# Altium project lan9254.PrjPcb (part 3 of 5)

## Sheet Page 05-LAN9254-Part2.SchDoc
size 416 x 264 mm; DrawnBy: Xuelu Li; Engineer: Parthiv/Xuelu; DocumentNumber: 5; Revision: A0; SheetNumber: 5; SheetTotal: 8; PageSetup: Record=PageOptions|CenterHorizontal=True|CenterVertical=True|PrintScale=1.02|XCorrection=1.00|YCorrection=1.00|PrintKind=0|BorderSize=5000000|LeftOffset=0|BottomOffset=0|Orientation=2|PaperLength=1000|PaperWidth=1000|Scale=100|PaperSource=15|PrintQuality=600|MediaType=1|DitherType=10|PrintScaleMode=1|PaperKind=11x17|PaperIndex=17; PageTitle: LAN9254-Page2; ProjName: EVB-LAN9254-DIGIO; DesignDescription: LAN9254 Evaluation Board; Designer: Xuelu Li; PartNumber: EVB-LAN9254-DIGIO; Sheet1Title: LAN9254-Page2; DocumentFullPathAndName: //depot_np_hweng_boards/ung_hweng/UNG_8017_EVB-USB5926/; ProjectName: lan9254.PrjPcb
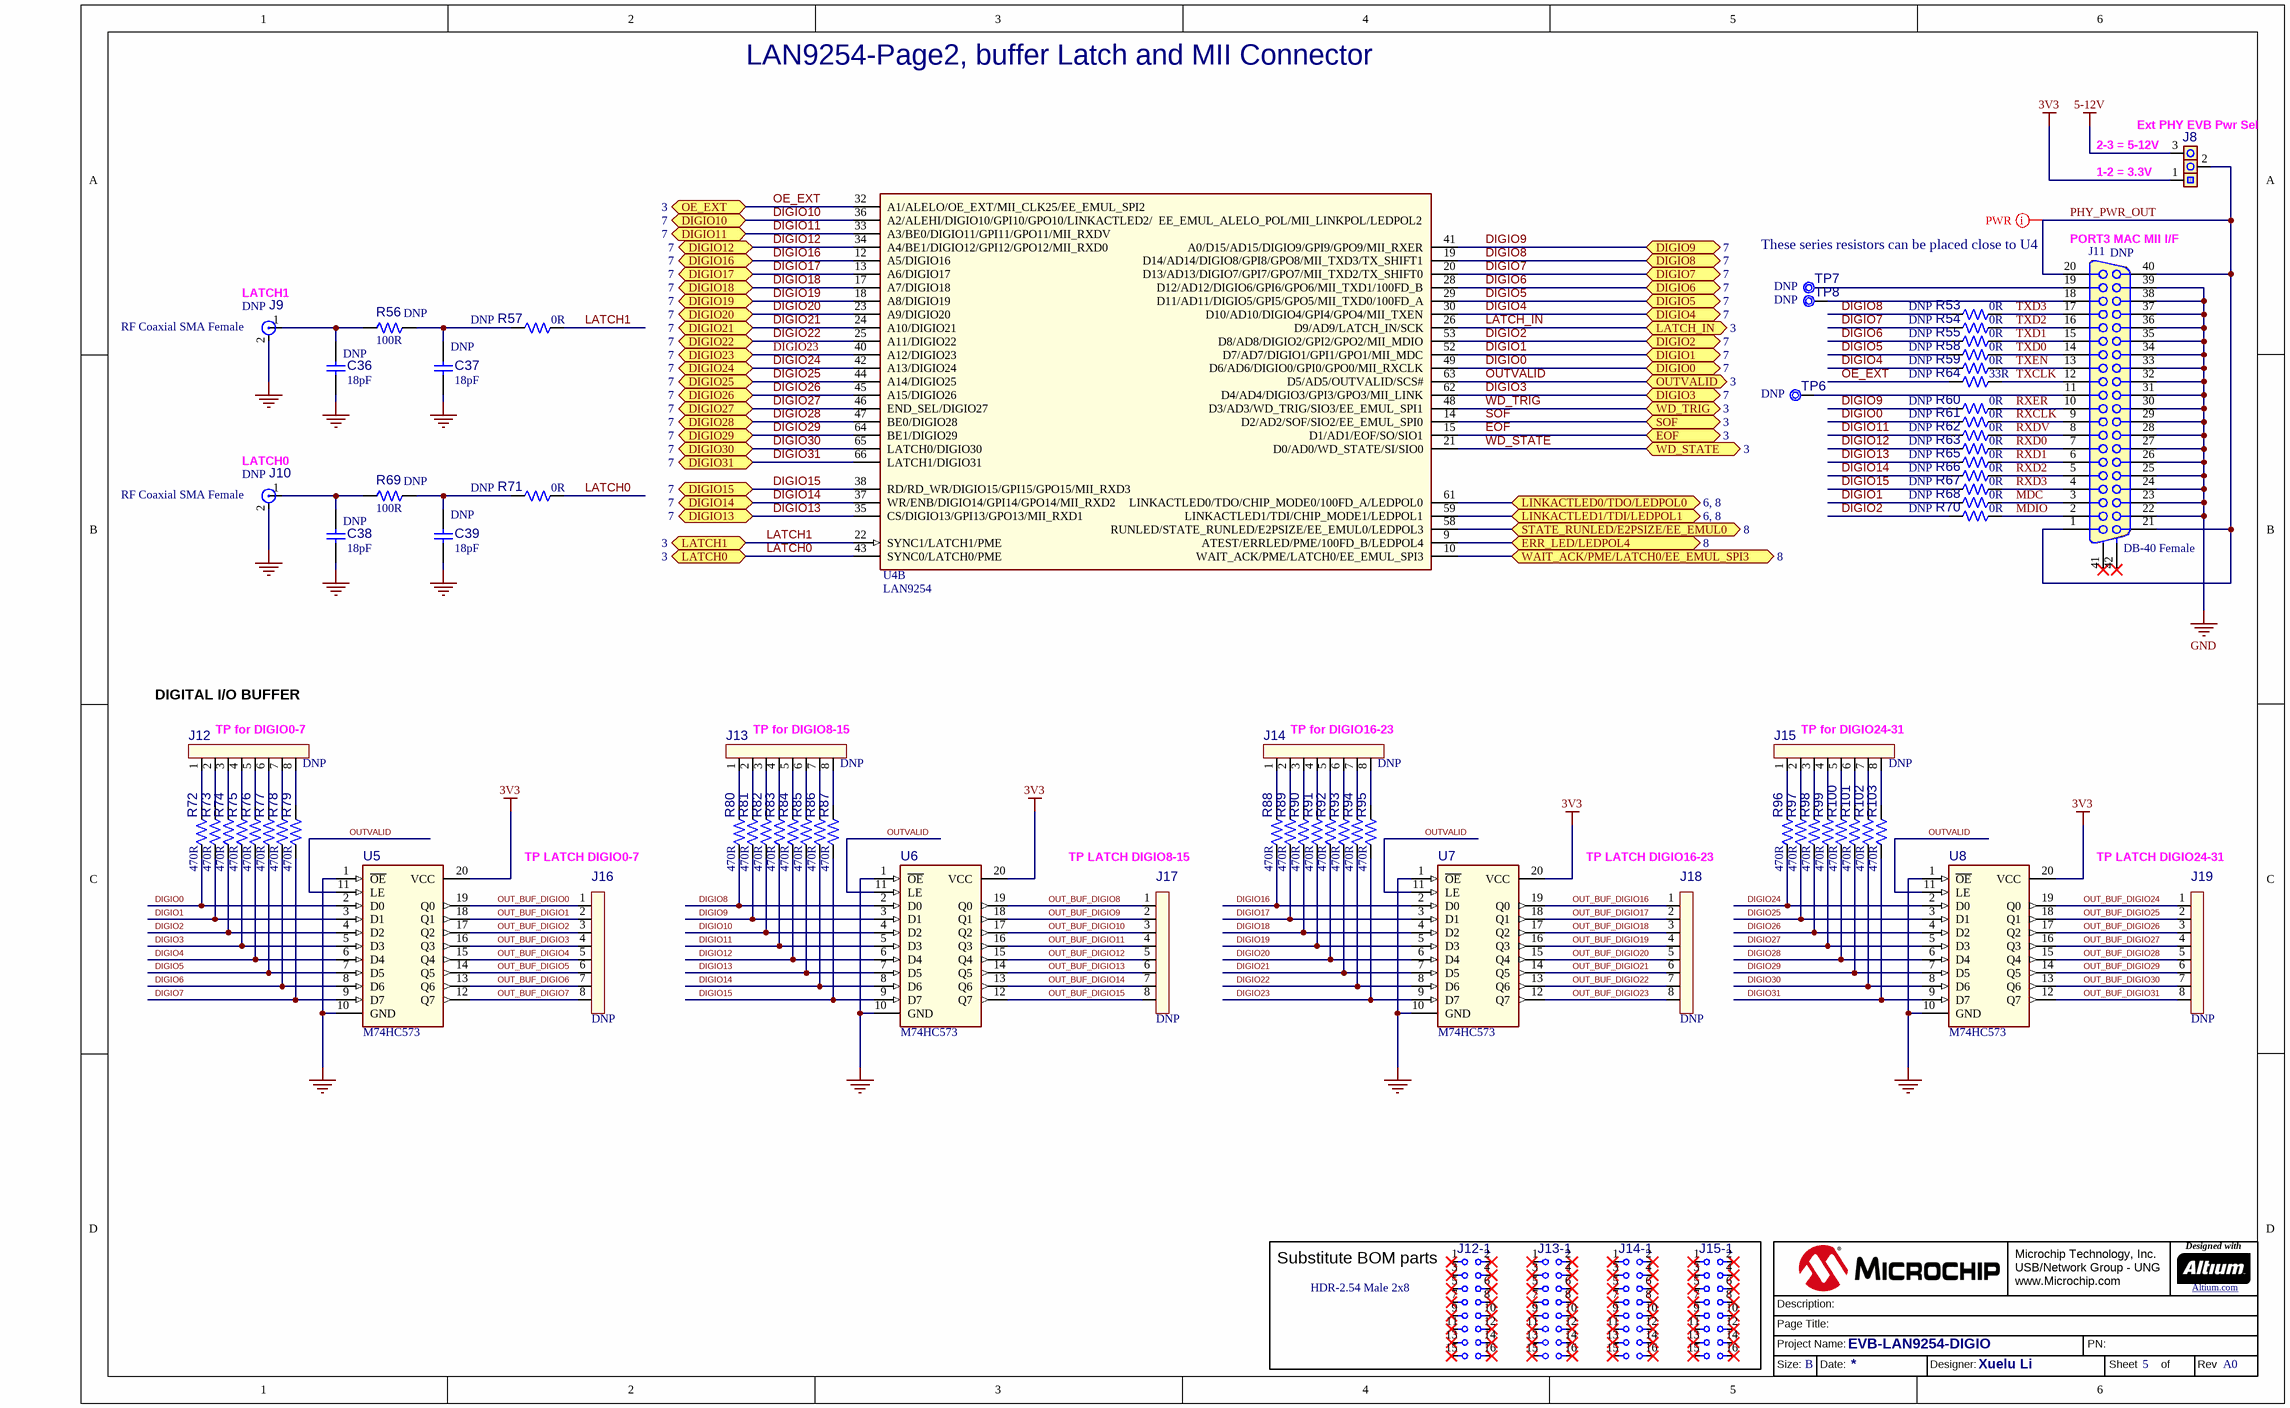
[diagram p4: Page 05-LAN9254-Part2.SchDoc]

### Parts
(Parts that share a designator on the sheet are numbered #1, #2 ... from top to bottom, then left to right.)
?#5  (no value)  (graphical)
C36  value 18pF  Populated: DNP  [CAP_C_0805]  (hidden comment: Capacitor NP)
C37  value 18pF  Populated: DNP  [CAP_C_0805]  (hidden comment: Capacitor NP)
C38  value 18pF  Populated: DNP  [CAP_C_0805]  (hidden comment: Capacitor NP)
C39  value 18pF  Populated: DNP  [CAP_C_0805]  (hidden comment: Capacitor NP)
J8  Header 1x3  [HDR_M_2.54_1x3]  (value not drawn)
J9  value RF Coaxial SMA Female  Populated: DNP  [CON_JACK_F_TH_V_ACP_901-144-8RFX]  (hidden comment: CON Jack 2 Pins)
J10  value RF Coaxial SMA Female  Populated: DNP  [CON_JACK_F_TH_V_ACP_901-144-8RFX]  (hidden comment: CON Jack 2 Pins)
J11  value DB-40 Female  Populated: DNP  [CON_DSUB40_TH_RA_F]  (hidden comment: CON DB-40)
J12  Populated: DNP  [HDR_M_2.54_1x8-doubled]  (hidden comment: HDR_M_2.54_1x8-doubled)  (no BOM)
J12-1  value HDR-2.54 Male 2x8  [HDR_M_2.54_2x8]  (hidden comment: Header 2x8)  (mechanical)
J13  Populated: DNP  [HDR_M_2.54_1x8-doubled]  (hidden comment: HDR_M_2.54_1x8-doubled)  (no BOM)
J13-1  Header 2x8  [HDR_M_2.54_2x8]  (value not drawn)  (mechanical)
J14  Populated: DNP  [HDR_M_2.54_1x8-doubled]  (hidden comment: HDR_M_2.54_1x8-doubled)  (no BOM)
J14-1  Header 2x8  [HDR_M_2.54_2x8]  (value not drawn)  (mechanical)
J15  Populated: DNP  [HDR_M_2.54_1x8-doubled]  (hidden comment: HDR_M_2.54_1x8-doubled)  (no BOM)
J15-1  Header 2x8  [HDR_M_2.54_2x8]  (value not drawn)  (mechanical)
J16  Populated: DNP  [HDR_M_2.54_1x8-stripped]  (hidden comment: HDR_M_2.54_1x8-stripped)  (no BOM)
J17  Populated: DNP  [HDR_M_2.54_1x8-stripped]  (hidden comment: HDR_M_2.54_1x8-stripped)  (no BOM)
J18  Populated: DNP  [HDR_M_2.54_1x8-stripped]  (hidden comment: HDR_M_2.54_1x8-stripped)  (no BOM)
J19  Populated: DNP  [HDR_M_2.54_1x8-stripped]  (hidden comment: HDR_M_2.54_1x8-stripped)  (no BOM)
R53  value 0R  Populated: DNP  [RES_C_0402]  (hidden comment: Resistor)
R54  value 0R  Populated: DNP  [RES_C_0402]  (hidden comment: Resistor)
R55  value 0R  Populated: DNP  [RES_C_0402]  (hidden comment: Resistor)
R56  value 100R  Populated: DNP  [RES_C_0805]  (hidden comment: Resistor)
R57  value 0R  Populated: DNP  [RES_C_0402]  (hidden comment: Resistor)
R58  value 0R  Populated: DNP  [RES_C_0402]  (hidden comment: Resistor)
R59  value 0R  Populated: DNP  [RES_C_0402]  (hidden comment: Resistor)
R60  value 0R  Populated: DNP  [RES_C_0402]  (hidden comment: Resistor)
R61  value 0R  Populated: DNP  [RES_C_0402]  (hidden comment: Resistor)
R62  value 0R  Populated: DNP  [RES_C_0402]  (hidden comment: Resistor)
R63  value 0R  Populated: DNP  [RES_C_0402]  (hidden comment: Resistor)
R64  value 33R  Populated: DNP  [RES_C_0402]  (hidden comment: Resistor)
R65  value 0R  Populated: DNP  [RES_C_0402]  (hidden comment: Resistor)
R66  value 0R  Populated: DNP  [RES_C_0402]  (hidden comment: Resistor)
R67  value 0R  Populated: DNP  [RES_C_0402]  (hidden comment: Resistor)
R68  value 0R  Populated: DNP  [RES_C_0402]  (hidden comment: Resistor)
R69  value 100R  Populated: DNP  [RES_C_0805]  (hidden comment: Resistor)
R70  value 0R  Populated: DNP  [RES_C_0402]  (hidden comment: Resistor)
R71  value 0R  Populated: DNP  [RES_C_0402]  (hidden comment: Resistor)
R72  value 470R  [RES_C_0402]  (hidden comment: Resistor)
R73  value 470R  [RES_C_0402]  (hidden comment: Resistor)
R74  value 470R  [RES_C_0402]  (hidden comment: Resistor)
R75  value 470R  [RES_C_0402]  (hidden comment: Resistor)
R76  value 470R  [RES_C_0402]  (hidden comment: Resistor)
R77  value 470R  [RES_C_0402]  (hidden comment: Resistor)
R78  value 470R  [RES_C_0402]  (hidden comment: Resistor)
R79  value 470R  [RES_C_0402]  (hidden comment: Resistor)
R80  value 470R  [RES_C_0402]  (hidden comment: Resistor)
R81  value 470R  [RES_C_0402]  (hidden comment: Resistor)
R82  value 470R  [RES_C_0402]  (hidden comment: Resistor)
R83  value 470R  [RES_C_0402]  (hidden comment: Resistor)
R84  value 470R  [RES_C_0402]  (hidden comment: Resistor)
R85  value 470R  [RES_C_0402]  (hidden comment: Resistor)
R86  value 470R  [RES_C_0402]  (hidden comment: Resistor)
R87  value 470R  [RES_C_0402]  (hidden comment: Resistor)
R88  value 470R  [RES_C_0402]  (hidden comment: Resistor)
R89  value 470R  [RES_C_0402]  (hidden comment: Resistor)
R90  value 470R  [RES_C_0402]  (hidden comment: Resistor)
R91  value 470R  [RES_C_0402]  (hidden comment: Resistor)
R92  value 470R  [RES_C_0402]  (hidden comment: Resistor)
R93  value 470R  [RES_C_0402]  (hidden comment: Resistor)
R94  value 470R  [RES_C_0402]  (hidden comment: Resistor)
R95  value 470R  [RES_C_0402]  (hidden comment: Resistor)
R96  value 470R  [RES_C_0402]  (hidden comment: Resistor)
R97  value 470R  [RES_C_0402]  (hidden comment: Resistor)
R98  value 470R  [RES_C_0402]  (hidden comment: Resistor)
R99  value 470R  [RES_C_0402]  (hidden comment: Resistor)
R100  value 470R  [RES_C_0402]  (hidden comment: Resistor)
R101  value 470R  [RES_C_0402]  (hidden comment: Resistor)
R102  value 470R  [RES_C_0402]  (hidden comment: Resistor)
R103  value 470R  [RES_C_0402]  (hidden comment: Resistor)
TP6  Populated: DNP  [TP_1.2x0.7]  (hidden comment: Test Point No BOM)  (no BOM)
TP7  Populated: DNP  [TP_1.2x0.7]  (hidden comment: Test Point No BOM)  (no BOM)
TP8  Populated: DNP  [TP_1.2x0.7]  (hidden comment: Test Point No BOM)  (no BOM)
U4  value LAN9254  [TQFP-80_12x12_EP6x6]  (hidden comment: LAN9254-SVB TQFP80)  (part B of 2)
U5  value M74HC573  [TSSOP-20]  (hidden comment: 74HC573 TSSOP-20)
U6  value M74HC573  [TSSOP-20]  (hidden comment: 74HC573 TSSOP-20)
U7  value M74HC573  [TSSOP-20]  (hidden comment: 74HC573 TSSOP-20)
U8  value M74HC573  [TSSOP-20]  (hidden comment: 74HC573 TSSOP-20)

### Blocks framed on the sheet
Substitute BOM parts: J12-1 J13-1 J14-1 J15-1

### Ports
DIGIO0 (bidir, see 7), DIGIO1 (bidir, see 7), DIGIO2 (bidir, see 7), DIGIO3 (bidir, see 7), DIGIO4 (bidir, see 7), DIGIO5 (bidir, see 7), DIGIO6 (bidir, see 7), DIGIO7 (bidir, see 7), DIGIO8 (bidir, see 7), DIGIO9 (bidir, see 7), DIGIO10 (bidir, see 7), DIGIO11 (bidir, see 7), DIGIO12 (bidir, see 7), DIGIO13 (bidir, see 7), DIGIO14 (bidir, see 7), DIGIO15 (bidir, see 7), DIGIO16 (bidir, see 7), DIGIO17 (bidir, see 7), DIGIO18 (bidir, see 7), DIGIO19 (bidir, see 7), DIGIO20 (bidir, see 7), DIGIO21 (bidir, see 7), DIGIO22 (bidir, see 7), DIGIO23 (bidir, see 7), DIGIO24 (bidir, see 7), DIGIO25 (bidir, see 7), DIGIO26 (bidir, see 7), DIGIO27 (bidir, see 7), DIGIO28 (bidir, see 7), DIGIO29 (bidir, see 7), DIGIO30 (bidir, see 7), DIGIO31 (bidir, see 7), EOF (bidir, see 3), ERR_LED/LEDPOL4 (bidir, see 8), LATCH0 (bidir, see 3), LATCH1 (bidir, see 3), LATCH_IN (bidir, see 3), LINKACTLED0/TDO/LEDPOL0 (bidir, see 6, 8), LINKACTLED1/TDI/LEDPOL1 (bidir, see 6, 8), OE_EXT (bidir, see 3), OUTVALID (bidir, see 3), SOF (bidir, see 3), STATE_RUNLED/E2PSIZE/EE_EMUL0 (bidir, see 8), WAIT_ACK/PME/LATCH0/EE_EMUL_SPI3 (bidir, see 8), WD_STATE (bidir, see 3), WD_TRIG (bidir, see 3)

### Nets
3V3: J8.1 U5.20(VCC) U6.20(VCC) U7.20(VCC) U8.20(VCC)
5-12V: J8.3
GND: C36.1 C37.1 C38.1 C39.1 J9.2 J10.2 J11.22 J11.23 J11.24 J11.25 J11.26 J11.27 J11.28 J11.29 J11.30 J11.31 J11.32 J11.33 J11.34 J11.35 J11.36 J11.37 J11.38 J11.39 U5.1(~{OE}) U5.10(GND) U6.1(~{OE}) U6.10(GND) U7.1(~{OE}) U7.10(GND) U8.1(~{OE}) U8.10(GND)
DIGIO0: R61.1 R72.1 U4.49(D6/AD6/DIGIO0/GPI0/GPO0/MII_RXCLK) U5.2(D0) ; port DIGIO0
DIGIO1: R68.1 R73.1 U4.52(D7/AD7/DIGIO1/GPI1/GPO1/MII_MDC) U5.3(D1) ; port DIGIO1
DIGIO2: R70.1 R74.1 U4.53(D8/AD8/DIGIO2/GPI2/GPO2/MII_MDIO) U5.4(D2) ; port DIGIO2
DIGIO3: R75.1 U4.62(D4/AD4/DIGIO3/GPI3/GPO3/MII_LINK) U5.5(D3) ; port DIGIO3
DIGIO4: R59.1 R76.1 U4.30(D10/AD10/DIGIO4/GPI4/GPO4/MII_TXEN) U5.6(D4) ; port DIGIO4
DIGIO5: R58.1 R77.1 U4.29(D11/AD11/DIGIO5/GPI5/GPO5/MII_TXD0/100FD_A) U5.7(D5) ; port DIGIO5
DIGIO6: R55.1 R78.1 U4.28(D12/AD12/DIGIO6/GPI6/GPO6/MII_TXD1/100FD_B) U5.8(D6) ; port DIGIO6
DIGIO7: R54.1 R79.1 U4.20(D13/AD13/DIGIO7/GPI7/GPO7/MII_TXD2/TX_SHIFT0) U5.9(D7) ; port DIGIO7
DIGIO8: R53.1 R80.1 U4.19(D14/AD14/DIGIO8/GPI8/GPO8/MII_TXD3/TX_SHIFT1) U6.2(D0) ; port DIGIO8
DIGIO9: R60.1 R81.1 U4.41(A0/D15/AD15/DIGIO9/GPI9/GPO9/MII_RXER) U6.3(D1) ; port DIGIO9
DIGIO10: R82.1 U4.36(A2/ALEHI/DIGIO10/GPI10/GPO10/LINKACTLED2/__EE_EMUL_ALELO_POL/MII_LINKPOL/LEDPOL2) U6.4(D2) ; port DIGIO10
DIGIO11: R62.1 R83.1 U4.33(A3/BE0/DIGIO11/GPI11/GPO11/MII_RXDV) U6.5(D3) ; port DIGIO11
DIGIO12: R63.1 R84.1 U4.34(A4/BE1/DIGIO12/GPI12/GPO12/MII_RXD0) U6.6(D4) ; port DIGIO12
DIGIO13: R65.1 R85.1 U4.35(CS/DIGIO13/GPI13/GPO13/MII_RXD1) U6.7(D5) ; port DIGIO13
DIGIO14: R66.1 R86.1 U4.37(WR/ENB/DIGIO14/GPI14/GPO14/MII_RXD2) U6.8(D6) ; port DIGIO14
DIGIO15: R67.1 R87.1 U4.38(RD/RD_WR/DIGIO15/GPI15/GPO15/MII_RXD3) U6.9(D7) ; port DIGIO15
DIGIO16: R88.1 U4.12(A5/DIGIO16) U7.2(D0) ; port DIGIO16
DIGIO17: R89.1 U4.13(A6/DIGIO17) U7.3(D1) ; port DIGIO17
DIGIO18: R90.1 U4.17(A7/DIGIO18) U7.4(D2) ; port DIGIO18
DIGIO19: R91.1 U4.18(A8/DIGIO19) U7.5(D3) ; port DIGIO19
DIGIO20: R92.1 U4.23(A9/DIGIO20) U7.6(D4) ; port DIGIO20
DIGIO21: R93.1 U4.24(A10/DIGIO21) U7.7(D5) ; port DIGIO21
DIGIO22: R94.1 U4.25(A11/DIGIO22) U7.8(D6) ; port DIGIO22
DIGIO23: R95.1 U4.40(A12/DIGIO23) U7.9(D7) ; port DIGIO23
DIGIO24: R96.1 U4.42(A13/DIGIO24) U8.2(D0) ; port DIGIO24
DIGIO25: R97.1 U4.44(A14/DIGIO25) U8.3(D1) ; port DIGIO25
DIGIO26: R98.1 U4.45(A15/DIGIO26) U8.4(D2) ; port DIGIO26
DIGIO27: R99.1 U4.46(END_SEL/DIGIO27) U8.5(D3) ; port DIGIO27
DIGIO28: R100.1 U4.47(BE0/DIGIO28) U8.6(D4) ; port DIGIO28
DIGIO29: R101.1 U4.64(BE1/DIGIO29) U8.7(D5) ; port DIGIO29
DIGIO30: R102.1 U4.65(LATCH0/DIGIO30) U8.8(D6) ; port DIGIO30
DIGIO31: R103.1 U4.66(LATCH1/DIGIO31) U8.9(D7) ; port DIGIO31
EOF: U4.15(D1/AD1/EOF/SO/SIO1) ; port EOF
ERR_LED/LEDPOL4: U4.9(ATEST/ERRLED/PME/100FD_B/LEDPOL4) ; port ERR_LED/LEDPOL4
LATCH0: R71.2 U4.43(SYNC0/LATCH0/PME) ; port LATCH0
LATCH1: R57.2 U4.22(SYNC1/LATCH1/PME) ; port LATCH1
LATCH_IN: U4.26(D9/AD9/LATCH_IN/SCK) ; port LATCH_IN
LINKACTLED0/TDO/LEDPOL0: U4.61(LINKACTLED0/TDO/CHIP_MODE0/100FD_A/LEDPOL0) ; port LINKACTLED0/TDO/LEDPOL0
LINKACTLED1/TDI/LEDPOL1: U4.59(LINKACTLED1/TDI/CHIP_MODE1/LEDPOL1) ; port LINKACTLED1/TDI/LEDPOL1
MDC: J11.3 R68.2
MDIO: J11.2 R70.2
OE_EXT: R64.1 U4.32(A1/ALELO/OE_EXT/MII_CLK25/EE_EMUL_SPI2) ; port OE_EXT
OUT_BUF_DIGIO0: J16.1 U5.19(Q0)
OUT_BUF_DIGIO1: J16.2 U5.18(Q1)
OUT_BUF_DIGIO2: J16.3 U5.17(Q2)
OUT_BUF_DIGIO3: J16.4 U5.16(Q3)
OUT_BUF_DIGIO4: J16.5 U5.15(Q4)
OUT_BUF_DIGIO5: J16.6 U5.14(Q5)
OUT_BUF_DIGIO6: J16.7 U5.13(Q6)
OUT_BUF_DIGIO7: J16.8 U5.12(Q7)
OUT_BUF_DIGIO8: J17.1 U6.19(Q0)
OUT_BUF_DIGIO9: J17.2 U6.18(Q1)
OUT_BUF_DIGIO10: J17.3 U6.17(Q2)
OUT_BUF_DIGIO11: J17.4 U6.16(Q3)
OUT_BUF_DIGIO12: J17.5 U6.15(Q4)
OUT_BUF_DIGIO13: J17.6 U6.14(Q5)
OUT_BUF_DIGIO14: J17.7 U6.13(Q6)
OUT_BUF_DIGIO15: J17.8 U6.12(Q7)
OUT_BUF_DIGIO16: J18.1 U7.19(Q0)
OUT_BUF_DIGIO17: J18.2 U7.18(Q1)
OUT_BUF_DIGIO18: J18.3 U7.17(Q2)
OUT_BUF_DIGIO19: J18.4 U7.16(Q3)
OUT_BUF_DIGIO20: J18.5 U7.15(Q4)
OUT_BUF_DIGIO21: J18.6 U7.14(Q5)
OUT_BUF_DIGIO22: J18.7 U7.13(Q6)
OUT_BUF_DIGIO23: J18.8 U7.12(Q7)
OUT_BUF_DIGIO24: J19.1 U8.19(Q0)
OUT_BUF_DIGIO25: J19.2 U8.18(Q1)
OUT_BUF_DIGIO26: J19.3 U8.17(Q2)
OUT_BUF_DIGIO27: J19.4 U8.16(Q3)
OUT_BUF_DIGIO28: J19.5 U8.15(Q4)
OUT_BUF_DIGIO29: J19.6 U8.14(Q5)
OUT_BUF_DIGIO30: J19.7 U8.13(Q6)
OUT_BUF_DIGIO31: J19.8 U8.12(Q7)
OUTVALID: U4.63(D5/AD5/OUTVALID/SCS#) U5.11(LE) U6.11(LE) U7.11(LE) U8.11(LE) ; port OUTVALID
PHY_PWR_OUT: J8.2 J11.1 J11.20 J11.21 J11.40
RXCLK: J11.9 R61.2
RXD0: J11.7 R63.2
RXD1: J11.6 R65.2
RXD2: J11.5 R66.2
RXD3: J11.4 R67.2
RXDV: J11.8 R62.2
RXER: J11.10 R60.2
SOF: U4.14(D2/AD2/SOF/SIO2/EE_EMUL_SPI0) ; port SOF
STATE_RUNLED/E2PSIZE/EE_EMUL0: U4.58(RUNLED/STATE_RUNLED/E2PSIZE/EE_EMUL0/LEDPOL3) ; port STATE_RUNLED/E2PSIZE/EE_EMUL0
TXCLK: J11.12 R64.2
TXD0: J11.14 R58.2
TXD1: J11.15 R55.2
TXD2: J11.16 R54.2
TXD3: J11.17 R53.2
TXEN: J11.13 R59.2
WAIT_ACK/PME/LATCH0/EE_EMUL_SPI3: U4.10(WAIT_ACK/PME/LATCH0/EE_EMUL_SPI3) ; port WAIT_ACK/PME/LATCH0/EE_EMUL_SPI3
WD_STATE: U4.21(D0/AD0/WD_STATE/SI/SIO0) ; port WD_STATE
WD_TRIG: U4.48(D3/AD3/WD_TRIG/SIO3/EE_EMUL_SPI1) ; port WD_TRIG
NetC36_2: C36.2 J9.1 R56.1
NetC37_2: C37.2 R56.2 R57.1
NetC38_2: C38.2 J10.1 R69.1
NetC39_2: C39.2 R69.2 R71.1
NetJ11_11: J11.11 TP6.1
NetJ11_18: J11.18 TP8.1
NetJ11_19: J11.19 TP7.1
NetJ12_1: J12.1 R72.2
NetJ12_2: J12.2 R73.2
NetJ12_3: J12.3 R74.2
NetJ12_4: J12.4 R75.2
NetJ12_5: J12.5 R76.2
NetJ12_6: J12.6 R77.2
NetJ12_7: J12.7 R78.2
NetJ12_8: J12.8 R79.2
NetJ13_1: J13.1 R80.2
NetJ13_2: J13.2 R81.2
NetJ13_3: J13.3 R82.2
NetJ13_4: J13.4 R83.2
NetJ13_5: J13.5 R84.2
NetJ13_6: J13.6 R85.2
NetJ13_7: J13.7 R86.2
NetJ13_8: J13.8 R87.2
NetJ14_1: J14.1 R88.2
NetJ14_2: J14.2 R89.2
NetJ14_3: J14.3 R90.2
NetJ14_4: J14.4 R91.2
NetJ14_5: J14.5 R92.2
NetJ14_6: J14.6 R93.2
NetJ14_7: J14.7 R94.2
NetJ14_8: J14.8 R95.2
NetJ15_1: J15.1 R96.2
NetJ15_2: J15.2 R97.2
NetJ15_3: J15.3 R98.2
NetJ15_4: J15.4 R99.2
NetJ15_5: J15.5 R100.2
NetJ15_6: J15.6 R101.2
NetJ15_7: J15.7 R102.2
NetJ15_8: J15.8 R103.2

Not connected (* = marked no-connect by the designer): J11 41* 42*; J12-1 1* 2* 3* 4* 5* 6* 7* 8* 9* 10* 11* 12* 13* 14* 15* 16*; J13-1 1* 2* 3* 4* 5* 6* 7* 8* 9* 10* 11* 12* 13* 14* 15* 16*; J14-1 1* 2* 3* 4* 5* 6* 7* 8* 9* 10* 11* 12* 13* 14* 15* 16*; J15-1 1* 2* 3* 4* 5* 6* 7* 8* 9* 10* 11* 12* 13* 14* 15* 16*

### Layout directives
net class Power: PHY_PWR_OUT

### Notes on the sheet
- LAN9254-Page2, buffer Latch and MII Connector
- (near J8) 2-3 = 5-12V
- (near J8) Ext PHY EVB Pwr Sel
- (near J8) 1-2 = 3.3V
- These series resistors can be placed close to U4
- (near J11) PORT3 MAC MII I/F
- (near J9) LATCH1
- (near J10) LATCH0
- DIGITAL I/O BUFFER
- (near J12) TP for DIGIO0-7
- (near J13) TP for DIGIO8-15
- (near J14) TP for DIGIO16-23
- (near J15) TP for DIGIO24-31
- (near J16) TP LATCH DIGIO0-7
- (near J17) TP LATCH DIGIO8-15
- (near J18) TP LATCH DIGIO16-23
- (near J19) TP LATCH DIGIO24-31
- Microchip Technology, Inc.
  USB/Network Group - UNG
  www.Microchip.com
- Designed with
- Altium.com <http://go.altium.com/MicrochipLandingPage_Evaluation.html>
- Page Title:
- Project Name:
- Description:
- PN:
- Size:
- B
- Date:
- Designer:
- Sheet
- of
- Rev

### Library data of the parts
?#5 = Title Block B_UNG1_Altium
C36-C39 = CAP0158: Capacitor; Manufacturer 1: Cal-Chip; Manufacturer Part Number 1: GMC21CG180J50NTLF; Voltage: 50V; Description_: CAP CER 18pF 50V 5% NP0 SMD 0805; Dev Tools Status: Production; Tolerance: 5%; Temperature Coeffcient: NP0; Type: Ceramic; MCHP-ID: CAP0158; Package: 0805; Revision: 2; Symbol: Capacitor NP; Status: MCL Design; ComponentLink1URL: https://chn-vm-apps.microchip.com/mchprepo/parts/Datasheets/XC-600124.pdf; ComponentLink1Description: SVN Datasheet; ComponentLink2URL: C:\ALTIUM_WORK\00001_MCHP-CDB\Datasheets\XC-600124.pdf; ComponentLink2Description: Local Datasheet; ComponentLink3URL: C:\ALTIUM_WORK\00001_MCHP-CDB\Library\LibraryRefs\Capacitor NP.SchLib; ComponentLink3Description: Open Symbol; ComponentLink4URL: C:\ALTIUM_WORK\00001_MCHP-CDB\Library\Footprints\CAP_C_0805.PcbLib; ComponentLink4Description: Open Footprint; ComponentLink5Description: Open Footprint 2; ComponentLink6Description: Open Footprint 3; ComponentLink7Description: Open Footprint 4; Operating Temperature: -55C to +125C; Category: Capacitor; Manufacturer 2: Panasonic; Manufacturer Part Number 2: ECJ-2VC1H180J; Manufacturer 3: Xicon; Manufacturer Part Number 3: CC501N180J; Manufacturer 4: NIC Components; Manufacturer Part Number 4: NMC0805NPO180J50TRPF; Manufacturer 5: Yageo; Manufacturer Part Number 5: CC0805JRNPO9BN180; Supplier 1: Cal-Chip; Supplier Part Number 1: GMC21CG180J50NTLF; Supplier 2: Digi-Key; Supplier Part Number 2: PCC180CNCT-ND; Supplier 3: Mouser; Supplier Part Number 3: CAP0158; Supplier 4: NIC Components; Supplier Part Number 4: NMC0805NPO180J50TRPF; Supplier 5: Digi-Key; Supplier Part Number 5: 311-1102-1-ND; Quantity Override: 1
J8 = CON0465: Manufacturer 1: Samtec; Manufacturer Part Number 1: TSW-103-07-T-S; Value: HDR-2.54 Male 1x3; Description_: CON HDR-2.54 Male 1x3 Tin 5.84MH TH VERT; Dev Tools Status: Production; Populated: DNP; MCHP-ID: CON0465; Revision: 1; Symbol: Header 1x3; Status: MCL Design; ComponentLink1URL: https://chn-vm-apps.microchip.com/mchprepo/parts/Datasheets/TSW-XXX-XX-XXX-X-XX-XXX-MKT.pdf; ComponentLink1Description: SVN Datasheet; ComponentLink2URL: C:\ALTIUM_WORK\00001_MCHP-CDB\Datasheets\TSW-XXX-XX-XXX-X-XX-XXX-MKT.pdf; ComponentLink2Description: Local Datasheet; ComponentLink3URL: C:\ALTIUM_WORK\00001_MCHP-CDB\Library\LibraryRefs\Header 1x3.SchLib; ComponentLink3Description: Open Symbol; ComponentLink4URL: C:\ALTIUM_WORK\00001_MCHP-CDB\Library\Footprints\HDR_M_2.54_1x3.PcbLib; ComponentLink4Description: Open Footprint; ComponentLink5Description: Open Footprint 2; ComponentLink6Description: Open Footprint 3; ComponentLink7Description: Open Footprint 4; Type: Header 2.54mm; Category: Connector; Manufacturer 2: SHENZHEN JUNHAO ENGINEERING; Manufacturer Part Number 2: R-211-0311-0021-000; Supplier 1: Digi-Key; Supplier Part Number 1: SAM1035-03-ND; Supplier 2: Raynen; Supplier Part Number 2: CONN00253B01; Quantity Override: 1
J9 J10 = CON1224: Manufacturer 1: TE Connectivity; Manufacturer Part Number 1: 5-1814832-1; Description_: CON RF Coaxial SMA Female 2P TH VERT; Dev Tools Status: Production; Owner: Jairuz Agang-ang; MCHP-ID: CON1224; Revision: 0; Symbol: CON Jack 2 Pins; Status: MCL Design; ComponentLink1URL: https://chn-vm-apps.microchip.com/mchprepo/parts/Datasheets/C901-144-8RFX.pdf; ComponentLink1Description: SVN Datasheet; ComponentLink2URL: C:\ALTIUM_WORK\00001_MCHP-CDB\Datasheets\C901-144-8RFX.pdf; ComponentLink2Description: Local Datasheet; ComponentLink3URL: C:\ALTIUM_WORK\00001_MCHP-CDB\Library\LibraryRefs\CON Jack 2 Pins.SchLib; ComponentLink3Description: Open Symbol; ComponentLink4URL: C:\ALTIUM_WORK\00001_MCHP-CDB\Library\Footprints\CON_JACK_F_TH_V_ACP_901-144-8RFX.PcbLib; ComponentLink4Description: Open Footprint; ComponentLink5Description: Open Footprint 2; ComponentLink6Description: Open Footprint 3; ComponentLink7Description: Open Footprint 4; Type: RF; Category: Connector; Manufacturer 2: Amphenol Commercial Products; Manufacturer Part Number 2: 901-144-8RFX; Supplier 1: Digi-Key; Supplier Part Number 1: A97594-ND; Supplier 2: Digi-Key; Supplier Part Number 2: ARFX1231-ND; Quantity Override: 1
J11 = CON1733: Manufacturer 1: TE Connectivity AMP Connectors; Manufacturer Part Number 1: 5787170-4; Description_: CON DSUB DB-40 FEMALE TH R/A; Dev Tools Status: Design; Owner: Sam Charles; Voltage: 30V; MCHP-ID: CON1733; Revision: A; Symbol: CON DB-40; Status: MCL Design; ComponentLink1URL: https://chn-vm-apps.microchip.com/mchprepo/parts/Datasheets/ENG_CD_5787170_B1.pdf; ComponentLink1Description: SVN Datasheet; ComponentLink2URL: C:\ALTIUM_WORK\00001_MCHP-CDB\Datasheets\ENG_CD_5787170_B1.pdf; ComponentLink2Description: Local Datasheet; ComponentLink3URL: C:\ALTIUM_WORK\00001_MCHP-CDB\Library\LibraryRefs\CON DB-40.SchLib; ComponentLink3Description: Open Symbol; ComponentLink4URL: C:\ALTIUM_WORK\00001_MCHP-CDB\Library\Footprints\CON_DSUB40_TH_RA_F.PcbLib; ComponentLink4Description: Open Footprint; ComponentLink5Description: Open Footprint 2; ComponentLink6Description: Open Footprint 3; ComponentLink7Description: Open Footprint 4; Type: DSUB; Category: Connector; Supplier 1: Digi-Key; Supplier Part Number 1: A31806-ND; Quantity Override: 1
J12-J19 = CON0104: CON HDR-2.54 Female 1x8 Gold TH; Manufacturer 1: Nextron; Manufacturer Part Number 1: 211-081A7-0021-400; Value: HDR-2.54 Male 1x8; Description_: CON HDR-2.54 Male 1x8 Gold 5.84MH TH VERT; Dev Tools Status: Production; MCHP-ID: CON0104; Revision: 1; Symbol: Header 1x8; Status: MCL Design; ComponentLink1URL: https://chn-vm-apps.microchip.com/mchprepo/parts/Datasheets/TSW-XXX-XX-XXX-X-XX-XXX-MKT.pdf; ComponentLink1Description: SVN Datasheet; ComponentLink2URL: C:\ALTIUM_WORK\00001_MCHP-CDB\Datasheets\TSW-XXX-XX-XXX-X-XX-XXX-MKT.pdf; ComponentLink2Description: Local Datasheet; ComponentLink3URL: C:\ALTIUM_WORK\00001_MCHP-CDB\Library\LibraryRefs\Header 1x8.SchLib; ComponentLink3Description: Open Symbol; ComponentLink4URL: C:\ALTIUM_WORK\00001_MCHP-CDB\Library\Footprints\HDR_M_2.54_1x8.PcbLib; ComponentLink4Description: Open Footprint; ComponentLink5Description: Open Footprint 2; ComponentLink6Description: Open Footprint 3; ComponentLink7Description: Open Footprint 4; Type: Header 2.54mm; Category: Connector; Manufacturer 2: Samtec; Manufacturer Part Number 2: TSW-108-07-L-S; Supplier 1: Nextron; Supplier Part Number 1: 211-081A7-0021-400; Supplier 2: Samtec; Supplier Part Number 2: TSW-108-07-L-S; Quantity Override: 1
J12-1 = CON1006: Manufacturer 1: FCI; Manufacturer Part Number 1: 68602-116HLF; Description_: CON HDR-2.54 Male 2x8 Gold 5.84MH TH VERT; Dev Tools Status: Production; Owner: Brent Lanphear; Populated: Yes; BOM Notes: Place at J12; MCHP-ID: CON1006; Revision: 2; Symbol: Header 2x8; Status: MCL Design; ComponentLink1URL: https://chn-vm-apps.microchip.com/mchprepo/parts/Datasheets/67996.pdf; ComponentLink1Description: SVN Datasheet; ComponentLink2URL: C:\ALTIUM_WORK\00001_MCHP-CDB\Datasheets\67996.pdf; ComponentLink2Description: Local Datasheet; ComponentLink3URL: C:\ALTIUM_WORK\00001_MCHP-CDB\Library\LibraryRefs\Header 2x8.SchLib; ComponentLink3Description: Open Symbol; ComponentLink4URL: C:\ALTIUM_WORK\00001_MCHP-CDB\Library\Footprints\HDR_M_2.54_2x8.PcbLib; ComponentLink4Description: Open Footprint; ComponentLink5Description: Open Footprint 2; ComponentLink6Description: Open Footprint 3; ComponentLink7Description: Open Footprint 4; Type: Header 2.54mm; Category: Connector; Manufacturer 2: Samtec Inc.; Manufacturer Part Number 2: TSW-108-07-L-D; Manufacturer 3: SHENZHEN JUNHAO ENGINEERING; Manufacturer Part Number 3: 213-161AE-0021-400; Supplier 1: Digi-Key; Supplier Part Number 1: 609-3364-ND; Supplier 2: Digi-Key; Supplier Part Number 2: SAM1030-08-ND; Supplier 3: Raynen; Supplier Part Number 3: CONN00269B01; Quantity Override: 1
J13-1 = CON1006: Manufacturer 1: FCI; Manufacturer Part Number 1: 68602-116HLF; Value: HDR-2.54 Male 2x8; Description_: CON HDR-2.54 Male 2x8 Gold 5.84MH TH VERT; Dev Tools Status: Production; Owner: Brent Lanphear; Populated: Yes; BOM Notes: Place at J13; MCHP-ID: CON1006; Revision: 2; Symbol: Header 2x8; Status: MCL Design; ComponentLink1URL: https://chn-vm-apps.microchip.com/mchprepo/parts/Datasheets/67996.pdf; ComponentLink1Description: SVN Datasheet; ComponentLink2URL: C:\ALTIUM_WORK\00001_MCHP-CDB\Datasheets\67996.pdf; ComponentLink2Description: Local Datasheet; ComponentLink3URL: C:\ALTIUM_WORK\00001_MCHP-CDB\Library\LibraryRefs\Header 2x8.SchLib; ComponentLink3Description: Open Symbol; ComponentLink4URL: C:\ALTIUM_WORK\00001_MCHP-CDB\Library\Footprints\HDR_M_2.54_2x8.PcbLib; ComponentLink4Description: Open Footprint; ComponentLink5Description: Open Footprint 2; ComponentLink6Description: Open Footprint 3; ComponentLink7Description: Open Footprint 4; Type: Header 2.54mm; Category: Connector; Manufacturer 2: Samtec Inc.; Manufacturer Part Number 2: TSW-108-07-L-D; Manufacturer 3: SHENZHEN JUNHAO ENGINEERING; Manufacturer Part Number 3: 213-161AE-0021-400; Supplier 1: Digi-Key; Supplier Part Number 1: 609-3364-ND; Supplier 2: Digi-Key; Supplier Part Number 2: SAM1030-08-ND; Supplier 3: Raynen; Supplier Part Number 3: CONN00269B01; Quantity Override: 1
J14-1 = CON1006: Manufacturer 1: FCI; Manufacturer Part Number 1: 68602-116HLF; Value: HDR-2.54 Male 2x8; Description_: CON HDR-2.54 Male 2x8 Gold 5.84MH TH VERT; Dev Tools Status: Production; Owner: Brent Lanphear; Populated: Yes; BOM Notes: Place at J14; MCHP-ID: CON1006; Revision: 2; Symbol: Header 2x8; Status: MCL Design; ComponentLink1URL: https://chn-vm-apps.microchip.com/mchprepo/parts/Datasheets/67996.pdf; ComponentLink1Description: SVN Datasheet; ComponentLink2URL: C:\ALTIUM_WORK\00001_MCHP-CDB\Datasheets\67996.pdf; ComponentLink2Description: Local Datasheet; ComponentLink3URL: C:\ALTIUM_WORK\00001_MCHP-CDB\Library\LibraryRefs\Header 2x8.SchLib; ComponentLink3Description: Open Symbol; ComponentLink4URL: C:\ALTIUM_WORK\00001_MCHP-CDB\Library\Footprints\HDR_M_2.54_2x8.PcbLib; ComponentLink4Description: Open Footprint; ComponentLink5Description: Open Footprint 2; ComponentLink6Description: Open Footprint 3; ComponentLink7Description: Open Footprint 4; Type: Header 2.54mm; Category: Connector; Manufacturer 2: Samtec Inc.; Manufacturer Part Number 2: TSW-108-07-L-D; Manufacturer 3: SHENZHEN JUNHAO ENGINEERING; Manufacturer Part Number 3: 213-161AE-0021-400; Supplier 1: Digi-Key; Supplier Part Number 1: 609-3364-ND; Supplier 2: Digi-Key; Supplier Part Number 2: SAM1030-08-ND; Supplier 3: Raynen; Supplier Part Number 3: CONN00269B01; Quantity Override: 1
J15-1 = CON1006: Manufacturer 1: FCI; Manufacturer Part Number 1: 68602-116HLF; Value: HDR-2.54 Male 2x8; Description_: CON HDR-2.54 Male 2x8 Gold 5.84MH TH VERT; Dev Tools Status: Production; Owner: Brent Lanphear; Populated: Yes; BOM Notes: Place at J15; MCHP-ID: CON1006; Revision: 2; Symbol: Header 2x8; Status: MCL Design; ComponentLink1URL: https://chn-vm-apps.microchip.com/mchprepo/parts/Datasheets/67996.pdf; ComponentLink1Description: SVN Datasheet; ComponentLink2URL: C:\ALTIUM_WORK\00001_MCHP-CDB\Datasheets\67996.pdf; ComponentLink2Description: Local Datasheet; ComponentLink3URL: C:\ALTIUM_WORK\00001_MCHP-CDB\Library\LibraryRefs\Header 2x8.SchLib; ComponentLink3Description: Open Symbol; ComponentLink4URL: C:\ALTIUM_WORK\00001_MCHP-CDB\Library\Footprints\HDR_M_2.54_2x8.PcbLib; ComponentLink4Description: Open Footprint; ComponentLink5Description: Open Footprint 2; ComponentLink6Description: Open Footprint 3; ComponentLink7Description: Open Footprint 4; Type: Header 2.54mm; Category: Connector; Manufacturer 2: Samtec Inc.; Manufacturer Part Number 2: TSW-108-07-L-D; Manufacturer 3: SHENZHEN JUNHAO ENGINEERING; Manufacturer Part Number 3: 213-161AE-0021-400; Supplier 1: Digi-Key; Supplier Part Number 1: 609-3364-ND; Supplier 2: Digi-Key; Supplier Part Number 2: SAM1030-08-ND; Supplier 3: Raynen; Supplier Part Number 3: CONN00269B01; Quantity Override: 1
R53-R55 R57-R63 R65-R68 R70 R71 = RSMT1040: Manufacturer 1: Yageo; Manufacturer Part Number 1: RC0402JR-070RL; Description_: RES TKF 0R 1/16W SMD 0402; Dev Tools Status: Production; Power: 1/16W; Owner: Sompoch Loboonlert; MCHP-ID: RSMT1040; Package: 0402; Revision: 2; Symbol: Resistor; Status: MCL Design; ComponentLink1URL: https://chn-vm-apps.microchip.com/mchprepo/parts/Datasheets/PYu-RC0402_51_RoHS_L_6.pdf; ComponentLink1Description: SVN Datasheet; ComponentLink2URL: C:\ALTIUM_WORK\00001_MCHP-CDB\Datasheets\PYu-RC0402_51_RoHS_L_6.pdf; ComponentLink2Description: Local Datasheet; ComponentLink3URL: C:\ALTIUM_WORK\00001_MCHP-CDB\Library\LibraryRefs\Resistor.SchLib; ComponentLink3Description: Open Symbol; ComponentLink4URL: C:\ALTIUM_WORK\00001_MCHP-CDB\Library\Footprints\RES_C_0402.PcbLib; ComponentLink4Description: Open Footprint; ComponentLink5Description: Open Footprint 2; ComponentLink6Description: Open Footprint 3; ComponentLink7Description: Open Footprint 4; Operating Temperature: -55C to +155C; Category: Resistor; Type: RES SMD; Composition: TKF; Supplier 1: Digi-Key; Supplier Part Number 1: 311-0.0JRCT-ND; Quantity Override: 1
R56 R69 = RES1375: Manufacturer 1: Panasonic Electronic Components; Manufacturer Part Number 1: ERA-S39J101V; Tolerance: 5%; Description_: RES MF 100R 5% 1/10W SMD 0805; Dev Tools Status: Production; Temperature Coeffcient: 3900ppm/C; Circuit Type: Isolated; Power: 1/10W; Owner: Jairuz Agang-ang; MCHP-ID: RES1375; Package: 0805; Revision: 1; Symbol: Resistor; Status: MCL Design; ComponentLink1URL: https://chn-vm-apps.microchip.com/mchprepo/parts/Datasheets/AOF0000CE1.pdf; ComponentLink1Description: SVN Datasheet; ComponentLink2URL: C:\ALTIUM_WORK\00001_MCHP-CDB\Datasheets\AOF0000CE1.pdf; ComponentLink2Description: Local Datasheet; ComponentLink3URL: C:\ALTIUM_WORK\00001_MCHP-CDB\Library\LibraryRefs\Resistor.SchLib; ComponentLink3Description: Open Symbol; ComponentLink4URL: C:\ALTIUM_WORK\00001_MCHP-CDB\Library\Footprints\RES_C_0805.PcbLib; ComponentLink4Description: Open Footprint; ComponentLink5Description: Open Footprint 2; ComponentLink6Description: Open Footprint 3; ComponentLink7Description: Open Footprint 4; Operating Temperature: -40C to +125C; Category: Resistor; Type: RES SMD; Composition: MF; Supplier 1: Digi-Key; Supplier Part Number 1: P100CECT-ND; Quantity Override: 1
R64 = RES1478: Manufacturer 1: Rohm Semiconductor; Manufacturer Part Number 1: MCR01MRTF33R0; Tolerance: 1%; Description_: RES TKF 33R 1% 1/16W SMD 0402; Dev Tools Status: Production; Voltage: 50V; Power: 1/16W; Owner: Mike Ragsdale; MCHP-ID: RES1478; Package: 0402; Revision: 1; Symbol: Resistor; Status: MCL Design; ComponentLink1URL: https://chn-vm-apps.microchip.com/mchprepo/parts/Datasheets/mcr_g.pdf; ComponentLink1Description: SVN Datasheet; ComponentLink2URL: C:\ALTIUM_WORK\00001_MCHP-CDB\Datasheets\mcr_g.pdf; ComponentLink2Description: Local Datasheet; ComponentLink3URL: C:\ALTIUM_WORK\00001_MCHP-CDB\Library\LibraryRefs\Resistor.SchLib; ComponentLink3Description: Open Symbol; ComponentLink4URL: C:\ALTIUM_WORK\00001_MCHP-CDB\Library\Footprints\RES_C_0402.PcbLib; ComponentLink4Description: Open Footprint; ComponentLink5Description: Open Footprint 2; ComponentLink6Description: Open Footprint 3; ComponentLink7Description: Open Footprint 4; Operating Temperature: -55C to +155C; Category: Resistor; Type: RES SMD; Composition: TKF; Supplier 1: Digi-Key; Supplier Part Number 1: RHM33.0CDCT-ND; Quantity Override: 1
R72-R103 = RSMT0337: Manufacturer 1: Panasonic; Manufacturer Part Number 1: ERJ-2GEJ471X; Tolerance: 5%; Description_: RES TKF 470R 5% 1/16W SMD 0402; Dev Tools Status: Production; Voltage: 50V; Temperature Coeffcient: 200ppm/C; Power: 1/16W; Populated: Yes; MCHP-ID: RSMT0337; Package: 0402; Revision: 1; Symbol: Resistor; Status: MCL Design; ComponentLink1URL: https://chn-vm-apps.microchip.com/mchprepo/parts/Datasheets/mcr_a.pdf; ComponentLink1Description: SVN Datasheet; ComponentLink2URL: C:\ALTIUM_WORK\00001_MCHP-CDB\Datasheets\mcr_a.pdf; ComponentLink2Description: Local Datasheet; ComponentLink3URL: C:\ALTIUM_WORK\00001_MCHP-CDB\Library\LibraryRefs\Resistor.SchLib; ComponentLink3Description: Open Symbol; ComponentLink4URL: C:\ALTIUM_WORK\00001_MCHP-CDB\Library\Footprints\RES_C_0402.PcbLib; ComponentLink4Description: Open Footprint; ComponentLink5Description: Open Footprint 2; ComponentLink6Description: Open Footprint 3; ComponentLink7Description: Open Footprint 4; Operating Temperature: -55C to +155C; Category: Resistor; Type: RES SMD; Composition: TKF; Manufacturer 2: ROHM; Manufacturer Part Number 2: MCR01MZPJ471; Supplier 1: Digi-Key; Supplier Part Number 1: P470JCT-ND; Supplier 2: Digi-Key; Supplier Part Number 2: RHM470JCT-ND; Quantity Override: 1
TP6-TP8 = CON1128: Test Point; Value: TP PAD PCB 1.2x0.7; Description_: CON TP PAD PCB 1.2x0.7 TH; Dev Tools Status: Production; Owner: Bogdan P (M91398); MCHP-ID: CON1128; Revision: 0; Symbol: Test Point No BOM; Status: MCL Design; ComponentLink1Description: SVN Datasheet; ComponentLink2Description: Local Datasheet; ComponentLink3URL: C:\ALTIUM_WORK\00001_MCHP-CDB\Library\LibraryRefs\Test Point No BOM.SchLib; ComponentLink3Description: Open Symbol; ComponentLink4URL: C:\ALTIUM_WORK\00001_MCHP-CDB\Library\Footprints\TP_1.2x0.7.PcbLib; ComponentLink4Description: Open Footprint; ComponentLink5Description: Open Footprint 2; ComponentLink6Description: Open Footprint 3; ComponentLink7Description: Open Footprint 4; Type: Test Point; Category: Connector; Quantity Override: 1
U4 = MIC8841: Manufacturer 1: Microchip Technology; Description_: MCHP INTERFACE 2/3-Port EtherCAT Slave Controller LAN9254 TQFP80; Dev Tools Status: Design; Owner: Manikandan Balakrishnan; Populated: YES; MCHP-ID: MIC8841; Symbol: LAN9254-SVB TQFP80; Type: Ethernet; Status: MCL Design; Revision: A; Category: MCHP-Interface; ComponentLink1Description: SVN Datasheet; ComponentLink2Description: Local Datasheet; ComponentLink3URL: C:\ALTIUM_WORK\00001_MCHP-CDB\Library\LibraryRefs\LAN9254-SVB TQFP80.SchLib; ComponentLink3Description: Open Symbol; ComponentLink4URL: C:\ALTIUM_WORK\00001_MCHP-CDB\Library\Footprints\TQFP-80_12x12_EP6x6.PcbLib; ComponentLink4Description: Open Footprint; ComponentLink5Description: Open Footprint 2; ComponentLink6Description: Open Footprint 3; ComponentLink7URL: C:\ALTIUM_WORK\00001_MCHP-CDB\Library\Footprints\TQFP-80_12x12_EP6x6_SOCKET.PcbLib; ComponentLink7Description: Open Footprint 4; Manufacturer Part Number 1: LAN9254; Supplier 1: Microchip Technology; Supplier Part Number 1: LAN9254; Quantity Override: 1
U5-U8 = IC1812: Manufacturer 1: STMicroelectronics; Manufacturer Part Number 1: M74HC573TTR; MCHP-ID: IC1812; Description_: IC LOGIC M74HC573 TRI STATE LATCH TSSOP-20; Dev Tools Status: Design; Vin: 2V - 6V; Owner: Sam Charles; Populated: YES; Revision: 1; ComponentLink5Description: Open Footprint 2; ComponentLink6Description: Open Footprint 3; ComponentLink7Description: Open Footprint 4; Symbol: 74HC573 TSSOP-20; Status: MCL Design; Package: TSSOP-20; ComponentLink1URL: https://chn-vm-apps.microchip.com/mchprepo/parts/Datasheets/en.CD00002537.pdf; ComponentLink1Description: SVN Datasheet; ComponentLink2URL: C:\ALTIUM_WORK\00001_MCHP-CDB\Datasheets\en.CD00002537.pdf; ComponentLink2Description: Local Datasheet; ComponentLink3URL: C:\ALTIUM_WORK\00001_MCHP-CDB\Library\LibraryRefs\74HC573 TSSOP-20.SchLib; ComponentLink3Description: Open Symbol; ComponentLink4URL: C:\ALTIUM_WORK\00001_MCHP-CDB\Library\Footprints\TSSOP-20.PcbLib; ComponentLink4Description: Open Footprint; Operating Temperature: -55°C ~ 125°C; Type: Logic; Category: IC; Supplier 1: Digi-Key; Supplier Part Number 1: 497-7385-1-ND; Quantity Override: 1